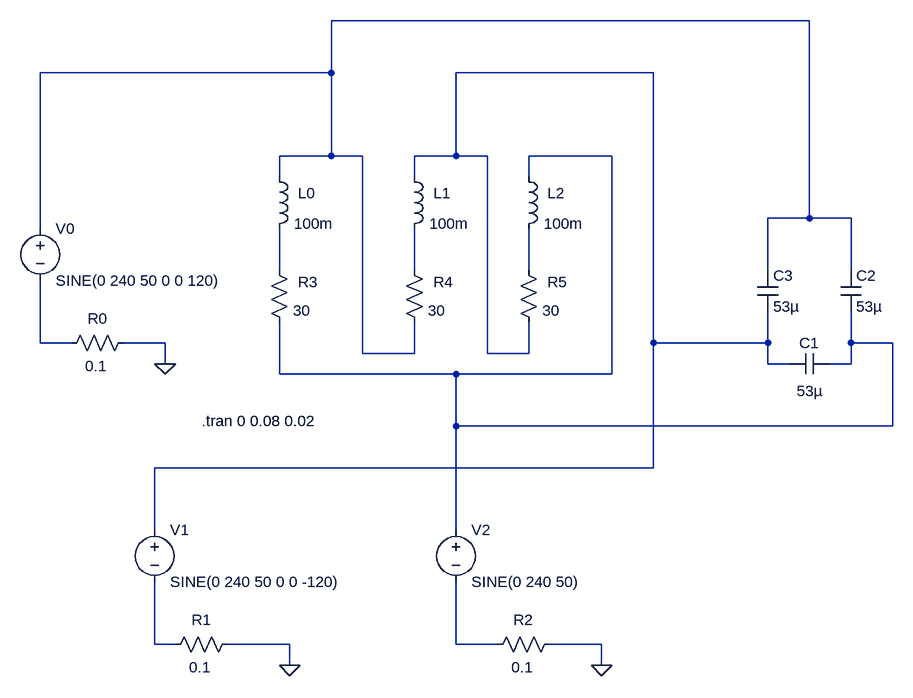
[diagram p0: schematic 3-phase_triangle_parallel_compensation_capacitor.asc]
3-phase_triangle_parallel_compensation_capacitor.asc, the LTspice schematic file:
Version 4
SHEET 1 1684 840
WIRE 1424 -240 688 -240
WIRE 688 -160 688 -240
WIRE 688 -160 240 -160
WIRE 1184 -160 880 -160
WIRE 688 -32 688 -160
WIRE 688 -32 608 -32
WIRE 736 -32 688 -32
WIRE 880 -32 880 -160
WIRE 880 -32 816 -32
WIRE 928 -32 880 -32
WIRE 1120 -32 992 -32
WIRE 608 0 608 -32
WIRE 816 0 816 -32
WIRE 992 0 992 -32
WIRE 1424 64 1424 -240
WIRE 1424 64 1360 64
WIRE 1488 64 1424 64
WIRE 240 80 240 -160
WIRE 608 144 608 80
WIRE 816 144 816 80
WIRE 992 144 992 80
WIRE 1360 144 1360 64
WIRE 1488 144 1488 64
WIRE 240 256 240 160
WIRE 288 256 240 256
WIRE 432 256 368 256
WIRE 1184 256 1184 -160
WIRE 1360 256 1360 208
WIRE 1360 256 1184 256
WIRE 1488 256 1488 208
WIRE 1552 256 1488 256
WIRE 736 272 736 -32
WIRE 816 272 816 224
WIRE 816 272 736 272
WIRE 928 272 928 -32
WIRE 992 272 992 224
WIRE 992 272 928 272
WIRE 432 288 432 256
WIRE 1360 288 1360 256
WIRE 1392 288 1360 288
WIRE 1488 288 1488 256
WIRE 1488 288 1456 288
WIRE 608 304 608 224
WIRE 880 304 608 304
WIRE 1120 304 1120 -32
WIRE 1120 304 880 304
WIRE 880 384 880 304
WIRE 1552 384 1552 256
WIRE 1552 384 880 384
WIRE 1184 448 1184 256
WIRE 1184 448 416 448
WIRE 416 544 416 448
WIRE 880 544 880 384
WIRE 416 720 416 624
WIRE 448 720 416 720
WIRE 624 720 528 720
WIRE 880 720 880 624
WIRE 944 720 880 720
WIRE 1104 720 1024 720
WIRE 624 752 624 720
WIRE 1104 752 1104 720
FLAG 432 288 0
FLAG 624 752 0
FLAG 1104 752 0
SYMBOL voltage 240 64 R0
WINDOW 123 0 0 Left 0
WINDOW 39 0 0 Left 0
SYMATTR InstName V0
SYMATTR Value SINE(0 240 50 0 0 120)
SYMBOL res 976 128 R0
WINDOW 0 45 34 Left 2
WINDOW 3 37 78 Left 2
SYMATTR InstName R5
SYMATTR Value 30
SYMBOL ind 976 -16 R0
WINDOW 0 45 41 Left 2
WINDOW 3 39 88 Left 2
SYMATTR InstName L2
SYMATTR Value 100m
SYMBOL cap 1344 144 R0
SYMATTR InstName C3
SYMATTR Value 53µ
SYMBOL voltage 416 528 R0
WINDOW 123 0 0 Left 0
WINDOW 39 0 0 Left 0
SYMATTR InstName V1
SYMATTR Value SINE(0 240 50 0 0 -120)
SYMBOL res 800 128 R0
WINDOW 0 45 34 Left 2
WINDOW 3 37 78 Left 2
SYMATTR InstName R4
SYMATTR Value 30
SYMBOL ind 800 -16 R0
WINDOW 0 45 41 Left 2
WINDOW 3 39 88 Left 2
SYMATTR InstName L1
SYMATTR Value 100m
SYMBOL cap 1456 272 R90
WINDOW 0 0 32 VBottom 2
WINDOW 3 42 31 VTop 2
SYMATTR InstName C1
SYMATTR Value 53µ
SYMBOL voltage 880 528 R0
WINDOW 123 0 0 Left 0
WINDOW 39 0 0 Left 0
SYMATTR InstName V2
SYMATTR Value SINE(0 240 50)
SYMBOL res 592 128 R0
WINDOW 0 45 34 Left 2
WINDOW 3 37 78 Left 2
SYMATTR InstName R3
SYMATTR Value 30
SYMBOL ind 592 -16 R0
WINDOW 0 45 41 Left 2
WINDOW 3 39 88 Left 2
SYMATTR InstName L0
SYMATTR Value 100m
SYMBOL cap 1472 144 R0
SYMATTR InstName C2
SYMATTR Value 53µ
SYMBOL res 1040 704 R90
WINDOW 0 -6 56 VBottom 2
WINDOW 3 36 58 VTop 2
SYMATTR InstName R2
SYMATTR Value 0.1
SYMBOL res 384 240 R90
WINDOW 0 -6 56 VBottom 2
WINDOW 3 36 58 VTop 2
SYMATTR InstName R0
SYMATTR Value 0.1
SYMBOL res 544 704 R90
WINDOW 0 -6 56 VBottom 2
WINDOW 3 36 58 VTop 2
SYMATTR InstName R1
SYMATTR Value 0.1
TEXT 488 376 Left 2 !.tran 0 0.08 0.02

The netlist it stands for:
* 3-phase_triangle_parallel_compensation_capacitor.asc
V0 N001 N007 SINE(0 240 50 0 0 120)
R5 N006 N002 30
L2 N003 N006 100m
C3 N001 N002 53µ
V1 N002 N008 SINE(0 240 50 0 0 -120)
R4 N005 N001 30
L1 N002 N005 100m
C1 N003 N002 53µ
V2 N003 N009 SINE(0 240 50)
R3 N004 N003 30
L0 N001 N004 100m
C2 N001 N003 53µ
R2 0 N009 0.1
R0 0 N007 0.1
R1 0 N008 0.1
.tran 0 0.08 0.02
.backanno
.end